# Altium schematic sheet relays_1-4.SchDoc
size B
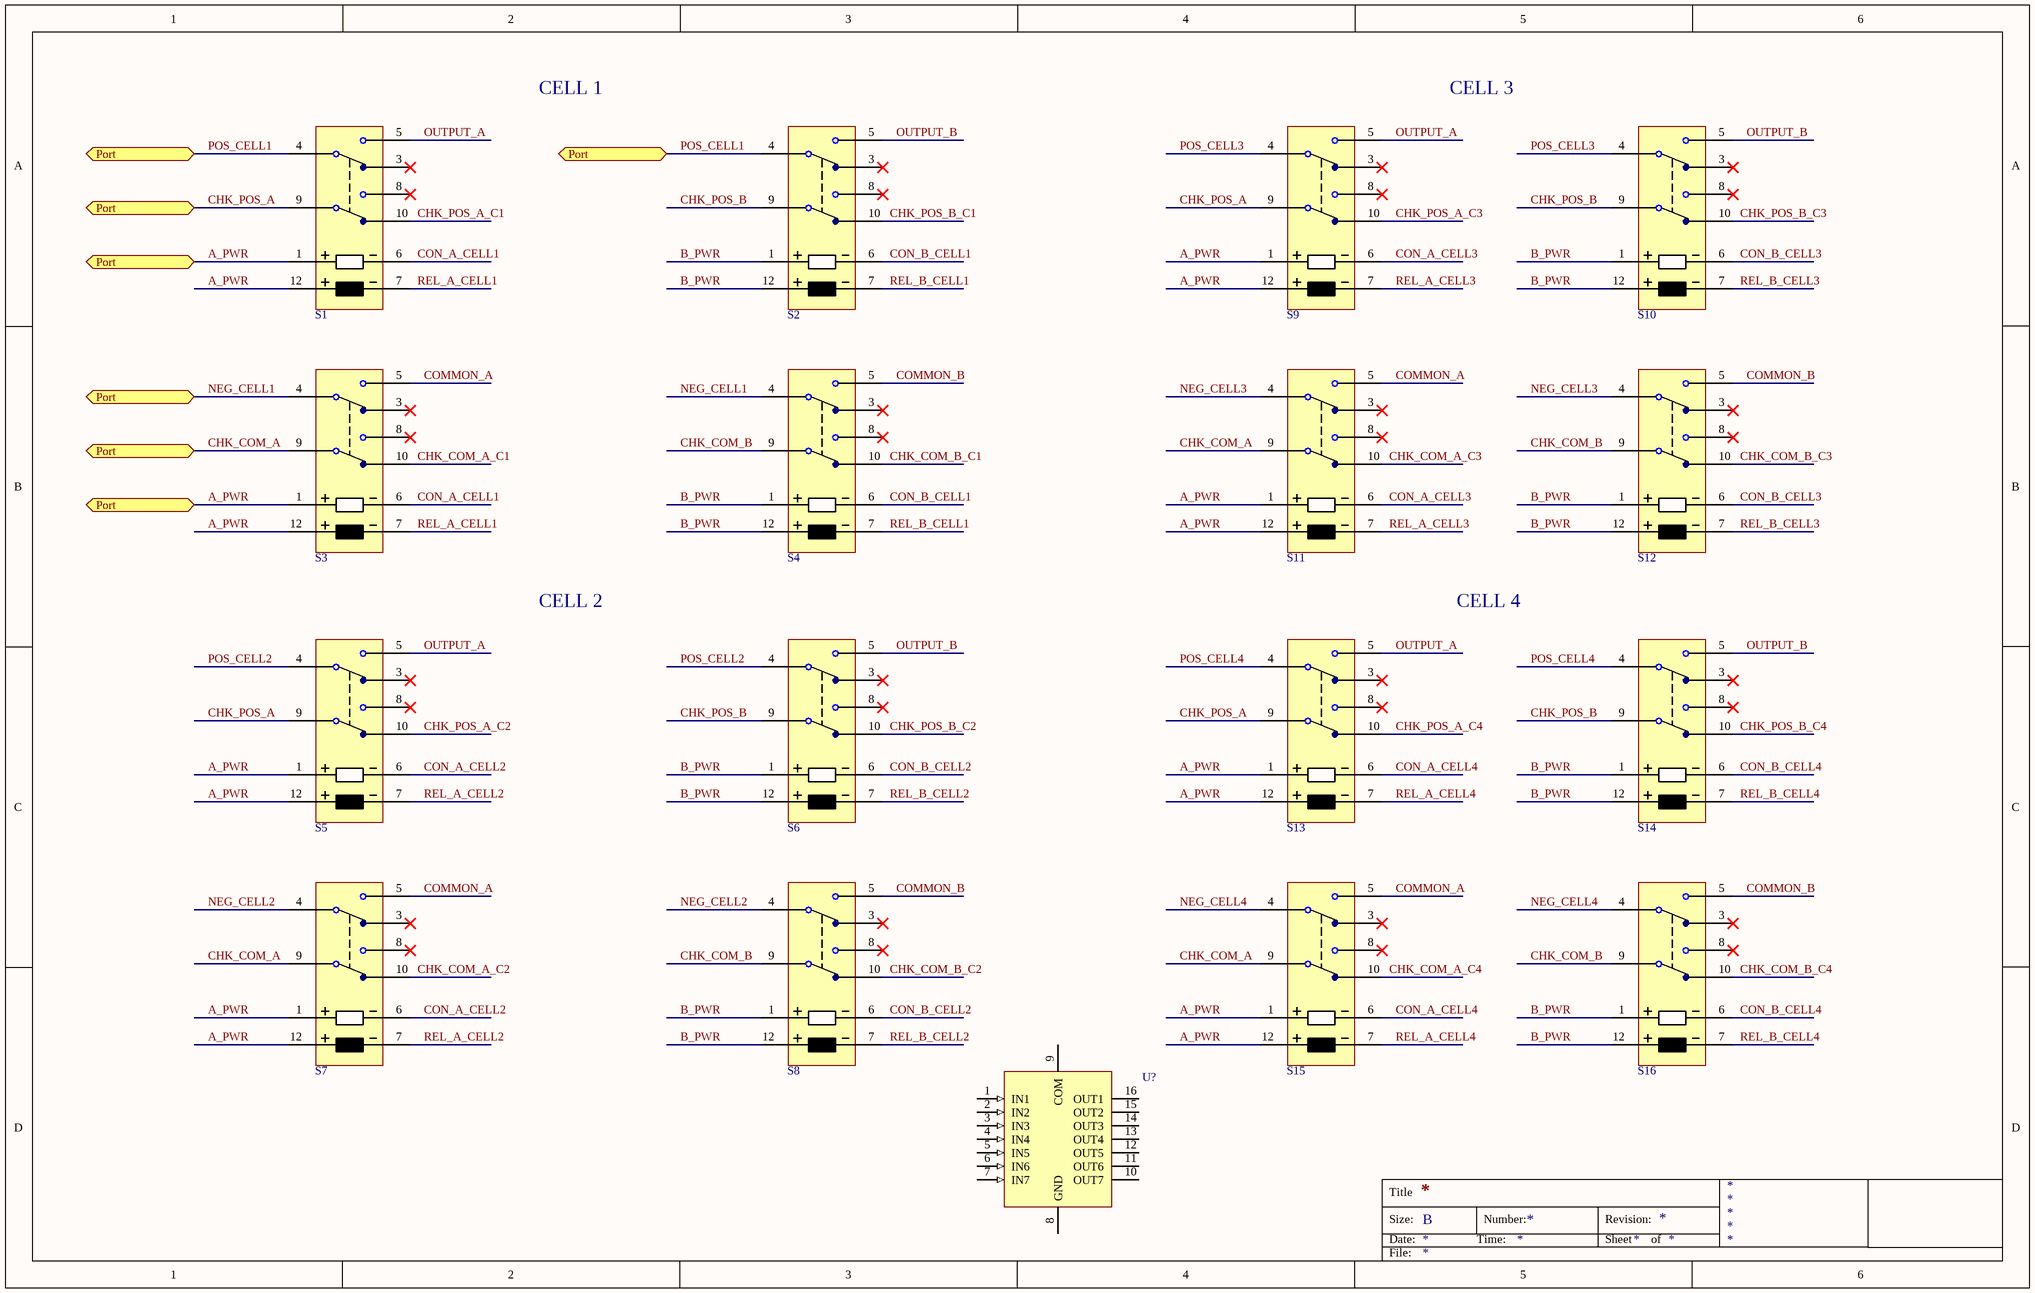
[diagram p0: relays_1-4.SchDoc]

## Parts
S1  DPDT_RELAY_L2  [L2_RELAY]  (value not drawn)
S2  DPDT_RELAY_L2  [L2_RELAY]  (value not drawn)
S3  DPDT_RELAY_L2  [L2_RELAY]  (value not drawn)
S4  DPDT_RELAY_L2  [L2_RELAY]  (value not drawn)
S5  DPDT_RELAY_L2  [L2_RELAY]  (value not drawn)
S6  DPDT_RELAY_L2  [L2_RELAY]  (value not drawn)
S7  DPDT_RELAY_L2  [L2_RELAY]  (value not drawn)
S8  DPDT_RELAY_L2  [L2_RELAY]  (value not drawn)
S9  DPDT_RELAY_L2  [L2_RELAY]  (value not drawn)
S10  DPDT_RELAY_L2  [L2_RELAY]  (value not drawn)
S11  DPDT_RELAY_L2  [L2_RELAY]  (value not drawn)
S12  DPDT_RELAY_L2  [L2_RELAY]  (value not drawn)
S13  DPDT_RELAY_L2  [L2_RELAY]  (value not drawn)
S14  DPDT_RELAY_L2  [L2_RELAY]  (value not drawn)
S15  DPDT_RELAY_L2  [L2_RELAY]  (value not drawn)
S16  DPDT_RELAY_L2  [L2_RELAY]  (value not drawn)
U?  ULN2003LV  [SOIC16P127_990X600X175L83X41N]  (value not drawn)

## Ports
Port

## Nets
A_PWR: S1.1 S1.4 S1.9 S1.12 S2.4 S3.1 S3.4 S3.9 S3.12 S4.4 S5.1 S5.9 S5.12 S7.1 S7.9 S7.12 S9.1 S9.9 S9.12 S11.1 S11.9 S11.12 S13.1 S13.9 S13.12 S15.1 S15.9 S15.12 ; port Port  [also labelled CHK_COM_A, CHK_POS_A, NEG_CELL1, POS_CELL1]
B_PWR: S2.1 S2.12 S4.1 S4.12 S6.1 S6.12 S8.1 S8.12 S10.1 S10.12 S12.1 S12.12 S14.1 S14.12 S16.1 S16.12
CHK_COM_A_C1: S3.10
CHK_COM_A_C2: S7.10
CHK_COM_A_C3: S11.10
CHK_COM_A_C4: S15.10
CHK_COM_B: S4.9 S8.9 S12.9 S16.9
CHK_COM_B_C1: S4.10
CHK_COM_B_C2: S8.10
CHK_COM_B_C3: S12.10
CHK_COM_B_C4: S16.10
CHK_POS_A_C1: S1.10
CHK_POS_A_C2: S5.10
CHK_POS_A_C3: S9.10
CHK_POS_A_C4: S13.10
CHK_POS_B: S2.9 S6.9 S10.9 S14.9
CHK_POS_B_C1: S2.10
CHK_POS_B_C2: S6.10
CHK_POS_B_C3: S10.10
CHK_POS_B_C4: S14.10
COMMON_A: S3.5 S7.5 S11.5 S15.5
COMMON_B: S4.5 S8.5 S12.5 S16.5
CON_A_CELL1: S1.6 S3.6
CON_A_CELL2: S5.6 S7.6
CON_A_CELL3: S9.6 S11.6
CON_A_CELL4: S13.6 S15.6
CON_B_CELL1: S2.6 S4.6
CON_B_CELL2: S6.6 S8.6
CON_B_CELL3: S10.6 S12.6
CON_B_CELL4: S14.6 S16.6
NEG_CELL2: S7.4 S8.4
NEG_CELL3: S11.4 S12.4
NEG_CELL4: S15.4 S16.4
OUTPUT_A: S1.5 S5.5 S9.5 S13.5
OUTPUT_B: S2.5 S6.5 S10.5 S14.5
POS_CELL2: S5.4 S6.4
POS_CELL3: S9.4 S10.4
POS_CELL4: S13.4 S14.4
REL_A_CELL1: S1.7 S3.7
REL_A_CELL2: S5.7 S7.7
REL_A_CELL3: S9.7 S11.7
REL_A_CELL4: S13.7 S15.7
REL_B_CELL1: S2.7 S4.7
REL_B_CELL2: S6.7 S8.7
REL_B_CELL3: S10.7 S12.7
REL_B_CELL4: S14.7 S16.7

Not connected (* = marked no-connect by the designer): S1 3* 8*; S2 3* 8*; S3 3* 8*; S4 3* 8*; S5 3* 8*; S6 3* 8*; S7 3* 8*; S8 3* 8*; S9 3* 8*; S10 3* 8*; S11 3* 8*; S12 3* 8*; S13 3* 8*; S14 3* 8*; S15 3* 8*; S16 3* 8*; U? 1(IN1) 2(IN2) 3(IN3) 4(IN4) 5(IN5) 6(IN6) 7(IN7) 8(GND) 9(COM) 10(OUT7) 11(OUT6) 12(OUT5) 13(OUT4) 14(OUT3) 15(OUT2) 16(OUT1)

## Notes on the sheet
- CELL 1
- CELL 3
- CELL 2
- CELL 4
- Title
- Size:
- Date:
- B
- Time:
- Number:
- Revision:
- Sheet
- of
- File:

## Library data of the parts
S1-S16 = TXS2-L2-4.5V: RELAY GEN PURPOSE DPDT 1A 4.5V; Manufacturer: Panasonic Electric Works; Relay Type: General Purpose; Coil Type: Latching, Dual Coil; Coil Voltage: 4.5VDC; Contact Form: DPDT (2 Form C); Switching Voltage: 110VDC - Max; Turn On Voltage (Max): 3.6 VDC; Coil Power: 70 mW; Design Item Id: TXS2-L2-4.5V; Supplier 1: Digi-Key; Supplier Part Number 1: 255-2340-5-ND; Manufacturer Part Number: TXS2-L2-4.5V; RoHS: RoHS Compliant; Category: Relays; Stock 1: 1242; Pricing 1: 1=5.28, 10=4.95, 25=4.4, 50=4.18, 100=3.96, 250=3.52, 500=3.3, 1000=3.08 (USD); Packaging: Tube; Features: Sealed - Fully; Operating Temperature: -40°C ~ 70°C; Mounting Type: Through Hole; ComponentLink1URL: http://www.panasonic-electric-works.com/eu-asset/en/downloads/ds_61022_en_txs.pdf; ComponentLink1Description: http://www.panasonic-electric-works.com/eu-asset/en/downloads/ds_61022_en_txs.pdf; Termination Style: PC Pin; Part Status: Active; Turn Off Voltage (Min): -; Contact Material: Silver (Ag), Gold (Au)
U? = ULN2003LVDR: IC POWER RELAY N-CHAN 16SOIC; Manufacturer: Texas Instruments; Current - Output (Max): 140mA; Switch Type: Relay, Solenoid Driver; Number of Outputs: 7; Output Configuration: Low Side; Output Type: N-Channel; Interface: Parallel; Voltage - Load: 8V (Max); Voltage - Supply (Vcc/Vdd): 1.8 V ~ 5 V; Input Type: Inverting; Design Item Id: ULN2003LVDR; Supplier 1: Digi-Key; Supplier Part Number 1: 296-30403-1-ND; Manufacturer Part Number: ULN2003LVDR; RoHS: RoHS Compliant; Category: Integrated Circuits (ICs); Stock 1: 9145; Pricing 1: 1=0.69, 10=0.61, 100=0.4679, 500=0.36988, 1000=0.2959 (USD); Packaging: Cut Tape (CT); Features: -; Operating Temperature: -40°C ~ 85°C (TA); Package / Case: 16-SOIC (0.154", 3.90mm Width); Supplier Device Package: 16-SOIC; ComponentLink1URL: http://www.ti.com/lit/ds/symlink/uln2003lv.pdf; ComponentLink1Description: http://www.ti.com/lit/ds/symlink/uln2003lv.pdf; Part Status: Active; Rds On (Typ): -; Fault Protection: -